# Altium schematic sheet LED.SchDoc
size A4
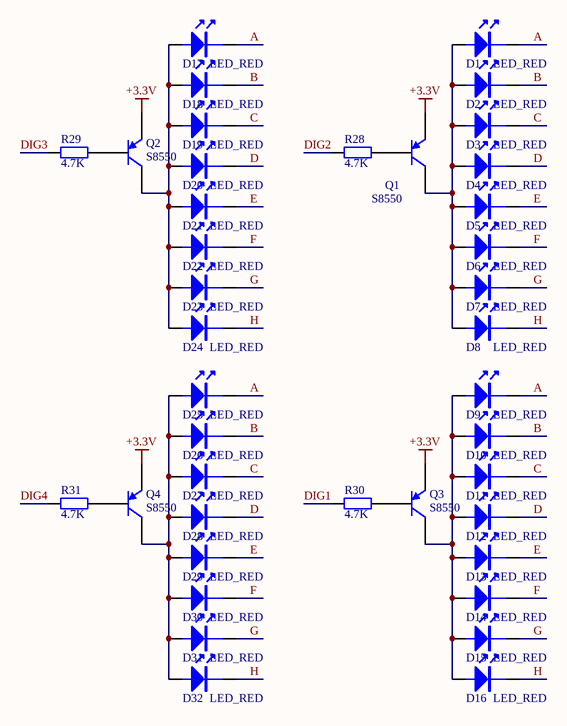
[diagram p0: LED.SchDoc]

## Parts
D1  LED_RED  [D0603]
D2  LED_RED  [D0603]
D3  LED_RED  [D0603]
D4  LED_RED  [D0603]
D5  LED_RED  [D0603]
D6  LED_RED  [D0603]
D7  LED_RED  [D0603]
D8  LED_RED  [D0603]
D9  LED_RED  [D0603]
D10  LED_RED  [D0603]
D11  LED_RED  [D0603]
D12  LED_RED  [D0603]
D13  LED_RED  [D0603]
D14  LED_RED  [D0603]
D15  LED_RED  [D0603]
D16  LED_RED  [D0603]
D17  LED_RED  [D0603]
D18  LED_RED  [D0603]
D19  LED_RED  [D0603]
D20  LED_RED  [D0603]
D21  LED_RED  [D0603]
D22  LED_RED  [D0603]
D23  LED_RED  [D0603]
D24  LED_RED  [D0603]
D25  LED_RED  [D0603]
D26  LED_RED  [D0603]
D27  LED_RED  [D0603]
D28  LED_RED  [D0603]
D29  LED_RED  [D0603]
D30  LED_RED  [D0603]
D31  LED_RED  [D0603]
D32  LED_RED  [D0603]
Q1  S8550  [SOT-23-3]
Q2  S8550  [SOT-23-3]
Q3  S8550  [SOT-23-3]
Q4  S8550  [SOT-23-3]
R28  4.7K  [0603]
R29  4.7K  [0603]
R30  4.7K  [0603]
R31  4.7K  [0603]

## Nets
+3.3V: Q1.3(E) Q2.3(E) Q3.3(E) Q4.3(E)
A: D1.K D9.K D17.K D25.K
B: D2.K D10.K D18.K D26.K
C: D3.K D11.K D19.K D27.K
D: D4.K D12.K D20.K D28.K
DIG1: R30.2
DIG2: R28.2
DIG3: R29.2
DIG4: R31.2
E: D5.K D13.K D21.K D29.K
F: D6.K D14.K D22.K D30.K
G: D7.K D15.K D23.K D31.K
H: D8.K D16.K D24.K D32.K
NetD1_A: D1.A D2.A D3.A D4.A D5.A D6.A D7.A D8.A Q1.1(C)
NetD9_A: D9.A D10.A D11.A D12.A D13.A D14.A D15.A D16.A Q3.1(C)
NetD17_A: D17.A D18.A D19.A D20.A D21.A D22.A D23.A D24.A Q2.1(C)
NetD25_A: D25.A D26.A D27.A D28.A D29.A D30.A D31.A D32.A Q4.1(C)
NetQ1_2: Q1.2(B) R28.1
NetQ2_2: Q2.2(B) R29.1
NetQ3_2: Q3.2(B) R30.1
NetQ4_2: Q4.2(B) R31.1

## Library data of the parts
D1-D32 = Pro5E.tmp_UnNamed_101: pin to pad: A>1 K>2
Q1-Q4 = PNP: PNP Bipolar Transistor; Published: 8-Jun-2000; LatestRevisionDate: 29-May-2009; LatestRevisionNote: IPC-7351 Footprint Added.; PackageVersion: Aug-1999; PackageReference: SOT-23B; Publisher: Altium Limited; PackageDescription: 3-Pin SOT-23 Package 0.95 mm Pitch, 2.4 mm Lead Span
R28-R31 = Res2: Resistor; Value: 5.1K; Published: 8-Jun-2000; LatestRevisionDate: 17-Jul-2002; LatestRevisionNote: Re-released for DXP Platform.; PackageReference: AXIAL-0.4; Publisher: Altium Limited